# Altium schematic sheet Fiber_interlock.SchDoc
size 420 x 297 mm; Address1: Address1; Address2: Address2; Address3: Address3; Address4: Address4; DocumentNumber: *Э3; SheetNumber: 8; SheetTotal: 11; DocumentType: Схема электрическая *
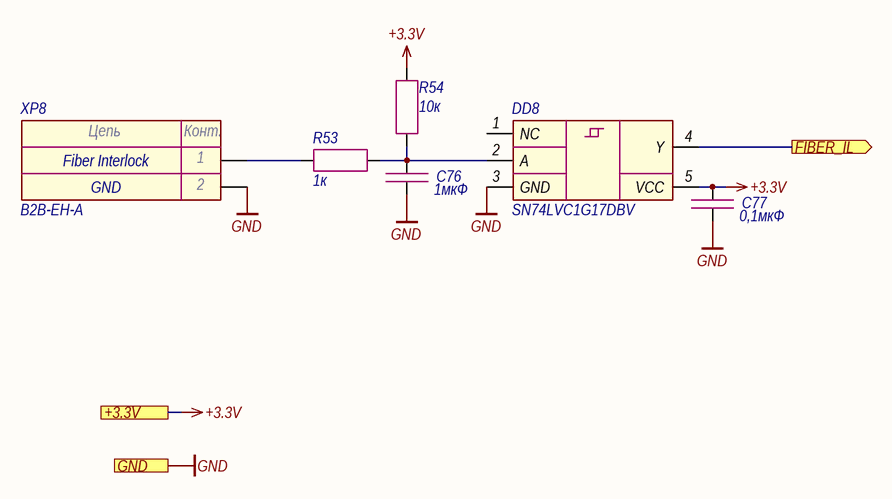
[diagram p0: Fiber_interlock.SchDoc]

## Parts
C76  1мкФ  [CAP_0603]
C77  0,1мкФ  [CAP_0603]
DD8  SN74LVC1G17DBV  [SOT-23-5]
R53  1к  [RES_0603]
R54  10к  [RES_0603]
XP8  B2B-EH-A  [B2B-EH-A]

## Ports
+3.3V (see Main[2A], Ethernet[3D], Flow_sensor[2C], Hardwiring[3D], LD_driver[1D], Power_supply[1D]), FIBER_IL (out, see Main[3A]), GND (see Main[2A], Ethernet[3D], Flow_sensor[2C], Guide_laser[1C], Hardwiring[3D], Indication[1C], LD_driver[1D], Power_supply[1D])

## Nets
+3.3V: C77.1 DD8.5(VCC) R54.2 ; port +3.3V
GND: C76.2 C77.2 DD8.3(GND) XP8.2 ; port GND
FIBER_IL: DD8.4(Y) ; port FIBER_IL
NetC76_1: C76.1 DD8.2(A) R53.2 R54.1
NetR53_1: R53.1 XP8.1

Not connected (* = marked no-connect by the designer): DD8 1(NC)

## Notes on the sheet
- (near XP8) Fiber Interlock
- GND
- Подп. и дата
- Инв. № дубл.
- Взам. инв. №
- Инв. № подл.
- Изм.
- Лист
- № докум.
- Подп.
- Дата
- Копировал
- Формат А3
- (in symbol Connector-2) Цепь; Конт.

## Library data of the parts
C76 = Capacitor: Manufacturer: Murata; Model: GRM188R61H105KAALD; Value: 1мкФ; Document: *
C77 = Capacitor: Manufacturer: Murata; Model: GRM188R71H104KA93D; Value: 0,1мкФ; Document: *
DD8 = SN74LVC1G17: Manufacturer: Texas Instruments; Model: SN74LVC1G17DBV; Document: *
R53 = Resistor: Manufacturer: Yageo; Model: RC0603FR-071KL; Value: 1к; Document: *
R54 = Resistor: Manufacturer: Yageo; Model: RC0603FR-0710KL; Value: 10к; Document: *
XP8 = Connector-2: Manufacturer: JST; Model: B2B-EH-A; Document: *